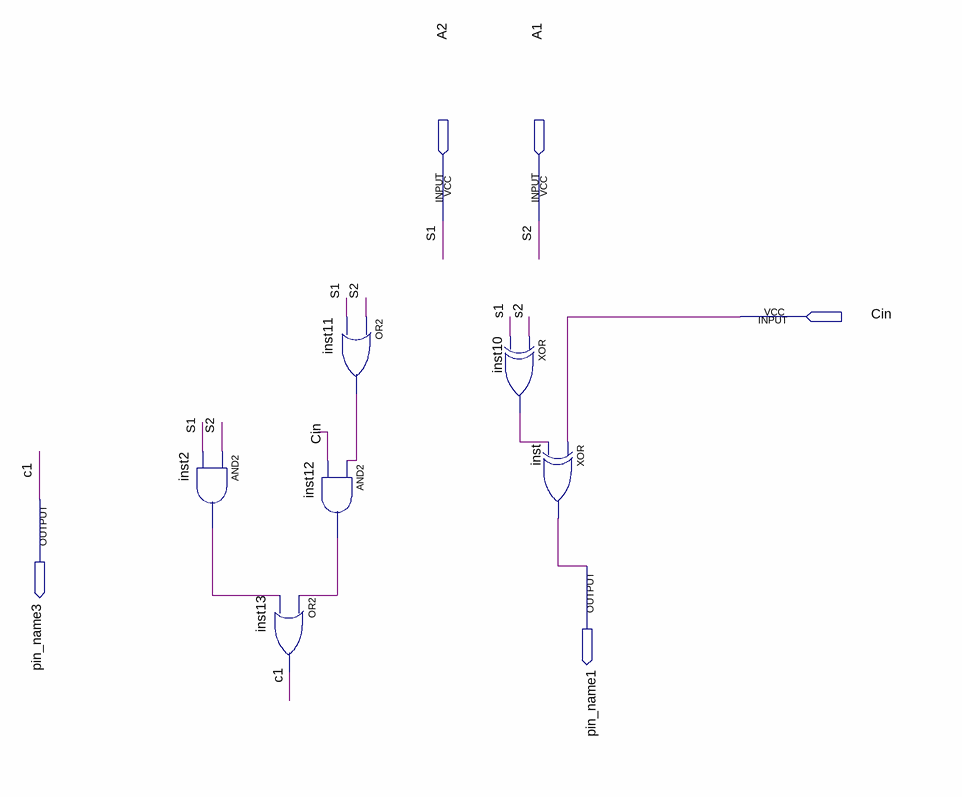
[diagram p0: schematic sheet]
// Quartus schematic somador.bdf as structural Verilog: 6 symbols, 5 pins
module somador (
  input  A2,
  input  A1,
  input  Cin,
  output pin_name3,
  output pin_name1
);

  wire inst2_out, inst10_out, inst11_out, inst12_out;

  and inst2 (inst2_out, A1, A2);
  or inst13 (pin_name3, inst12_out, inst2_out);
  or inst11 (inst11_out, A1, A2);
  and inst12 (inst12_out, inst11_out, Cin);
  xor inst10 (inst10_out, A1, A2);
  xor inst (pin_name1, Cin, inst10_out);

  // Other names for the same wires on the sheet: c1 = pin_name3; S1 = A2; S2 = A1
endmodule
